# EAGLE design ESP32boardforCNCFTDI (EAGLE 9.6.2)
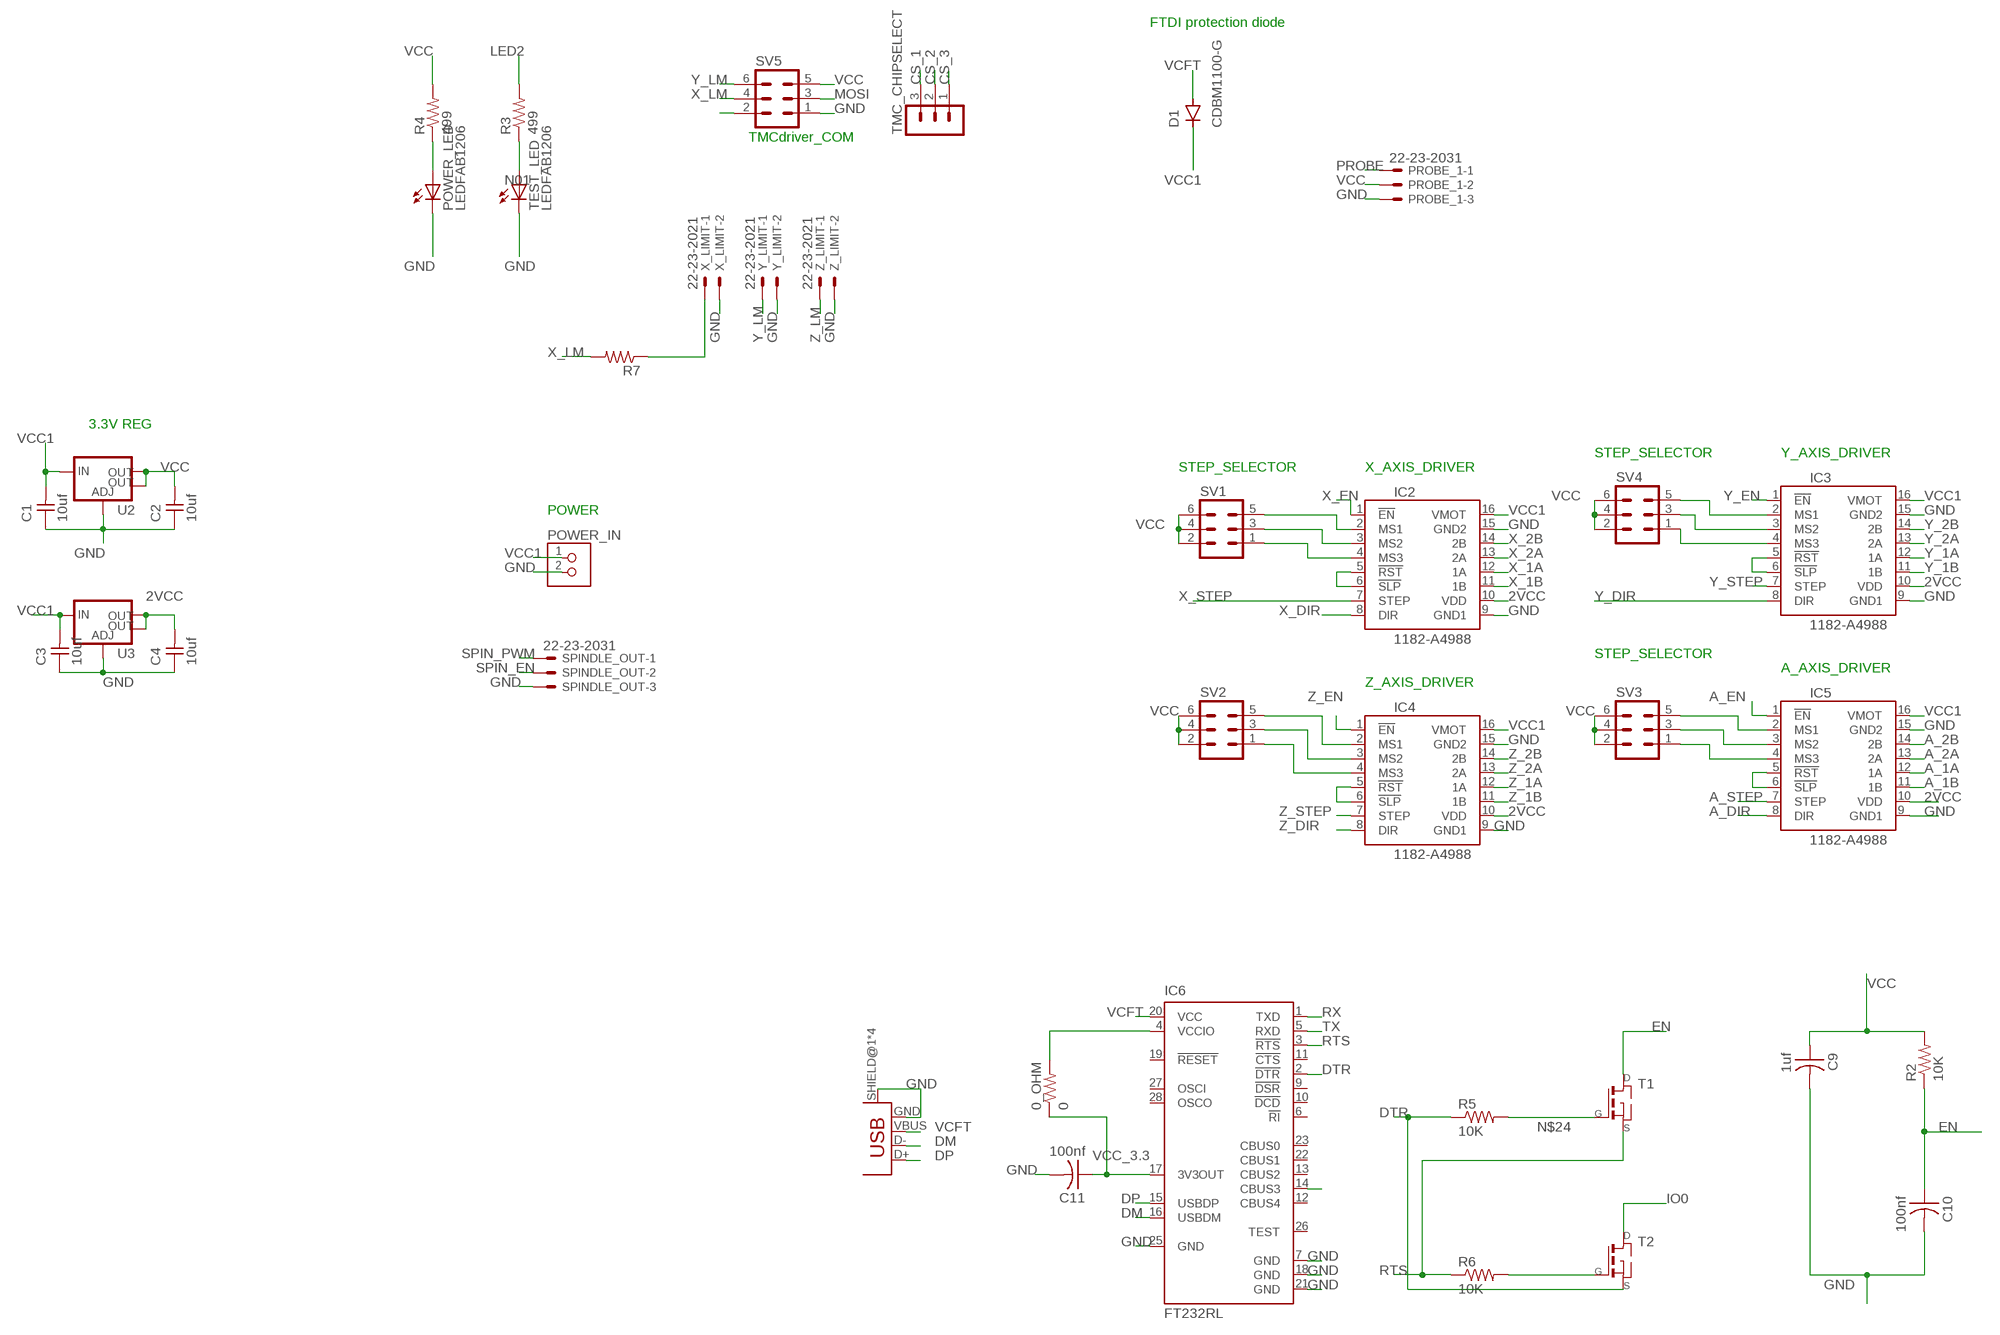
[diagram p0: schematic, sheet 1, part 1 of 2]
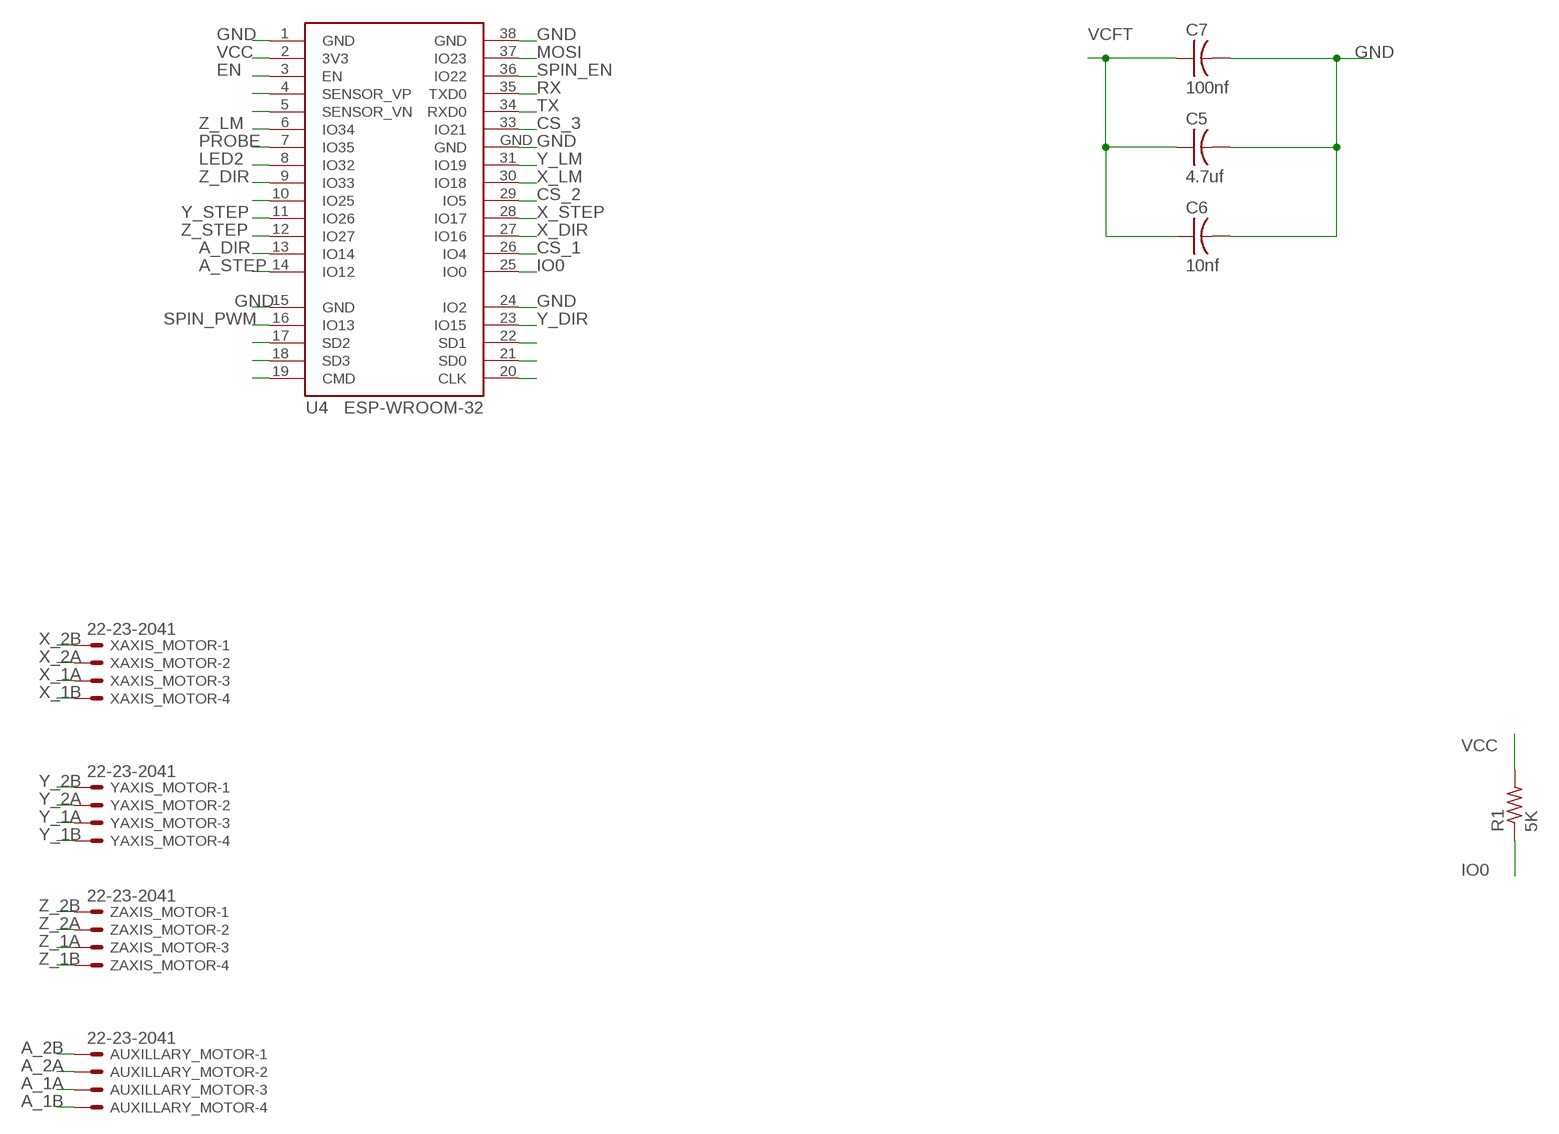
[diagram p1: schematic, sheet 1, part 2 of 2]

## Parts
0_OHM  0  RES-US1206FAB  [R1206FAB]
AUXILLARY_MOTOR  22-23-2041  [22-23-2041]
C1  10uf  CAP-UNPOLARIZEDFAB  [C1206FAB]
C2  10uf  CAP-UNPOLARIZEDFAB  [C1206FAB]
C3  10uf  CAP-UNPOLARIZEDFAB  [C1206FAB]
C4  10uf  CAP-UNPOLARIZEDFAB  [C1206FAB]
C5  4.7uf  CAP-US1206FAB  [C1206FAB]
C6  10nf  CAP-US1206FAB  [C1206FAB]
C7  100nf  CAP-US1206FAB  [C1206FAB]
C9  1uf  CAP-US1206FAB  [C1206FAB]
C10  100nf  CAP-US1206FAB  [C1206FAB]
C11  100nf  CAP-US1206FAB  [C1206FAB]
D1  CDBM1100-G  [MINI-SMA]
IC2  1182-A4988  [A4988]
IC3  1182-A4988  [A4988]
IC4  1182-A4988  [A4988]
IC5  1182-A4988  [A4988]
IC6  FT232RL  [SSOP28]
POWER_IN  TERM-1X02-ADAFRUIT  [3.5MMTERM]
POWER_LED  LEDFAB1206  [LED1206FAB]
PROBE_1  22-23-2031  [22-23-2031]
R1  5K  RES-US1206FAB  [R1206FAB]
R2  10K  RES-US1206FAB  [R1206FAB]
R3  499  RES-US1206FAB  [R1206FAB]
R4  499  RES-US1206FAB  [R1206FAB]
R5  10K  RES-US1206FAB  [R1206FAB]
R6  10K  RES-US1206FAB  [R1206FAB]
R7  RES-US1206FAB  [R1206FAB]
SPINDLE_OUT  22-23-2031  [22-23-2031]
SV1  MA03-2  [MA03-2]
SV2  MA03-2  [MA03-2]
SV3  MA03-2  [MA03-2]
SV4  MA03-2  [MA03-2]
SV5  MA03-2  [MA03-2]
T1  NMOSFETSOT23  [SOT-23]
T2  NMOSFETSOT23  [SOT-23]
TEST_LED  LEDFAB1206  [LED1206FAB]
TMC_CHIPSELECT  MA03-1  [MA03-1]
U2  V_REG_LM1117SOT223  [SOT223]
U3  V_REG_LM1117SOT223  [SOT223]
U4  ESP-WROOM-32  [ESP-WROOM-32]
U$1  USB_MINIB  [USB_MINIB]
X_LIMIT  22-23-2021  [22-23-2021]
XAXIS_MOTOR  22-23-2041  [22-23-2041]
Y_LIMIT  22-23-2021  [22-23-2021]
YAXIS_MOTOR  22-23-2041  [22-23-2041]
Z_LIMIT  22-23-2021  [22-23-2021]
ZAXIS_MOTOR  22-23-2041  [22-23-2041]

## Nets
2VCC: C4.2 IC2.10(VDD) IC3.10(VDD) IC4.10(VDD) IC5.10(VDD) U3.2(OUT) U3.4(OUT)
A_1A: AUXILLARY_MOTOR.3 IC5.12(1A)
A_1B: AUXILLARY_MOTOR.4 IC5.11(1B)
A_2A: AUXILLARY_MOTOR.2 IC5.13(2A)
A_2B: AUXILLARY_MOTOR.1 IC5.14(2B)
A_DIR: IC5.8(DIR) U4.13(IO14)
A_EN: IC5.1(!EN)
A_STEP: IC5.7(STEP) U4.14(IO12)
CS_1: TMC_CHIPSELECT.3 U4.26(IO4)
CS_2: TMC_CHIPSELECT.2 U4.29(IO5)
CS_3: TMC_CHIPSELECT.1 U4.33(IO21)
DM: IC6.16(USBDM) U$1.D-
DP: IC6.15(USBDP) U$1.D+
DTR: IC6.2(!DTR) R5.1 T2.2(S)
EN: C10.1 R2.1 T1.1(D) U4.3(EN)
GND: C1.1 C2.1 C3.1 C4.1 C5.2 C6.2 C7.2 C9.2 C10.2 C11.2 IC2.9(GND1) IC2.15(GND2) IC3.9(GND1) IC3.15(GND2) IC4.9(GND1) IC4.15(GND2) IC5.9(GND1) IC5.15(GND2) IC6.7(GND) IC6.18(GND) IC6.21(GND) IC6.25(GND) POWER_IN.2 POWER_LED.2(C) PROBE_1.3 SPINDLE_OUT.3 SV5.1 TEST_LED.2(C) U2.1(ADJ) U3.1(ADJ) U4.1(GND) U4.15(GND) U4.24(IO2) U4.38(GND) U4.GND U$1.GND U$1.SHIELD@1(SHIELD) U$1.SHIELD@2(SHIELD) U$1.SHIELD@3(SHIELD) U$1.SHIELD@4(SHIELD) X_LIMIT.2 Y_LIMIT.2 Z_LIMIT.2
IO0: R1.1 T2.1(D) U4.25(IO0)
LED2: R3.2 U4.8(IO32)
MOSI: SV5.3 U4.37(IO23)
N01: R3.1 TEST_LED.1(A)
N$1: POWER_LED.1(A) R4.1
N$2: IC2.5(!RST) IC2.6(!SLP)
N$3: IC3.5(!RST) IC3.6(!SLP)
N$4: IC4.5(!RST) IC4.6(!SLP)
N$5: IC5.5(!RST) IC5.6(!SLP)
N$6: IC4.2(MS1) SV2.5
N$7: R7.1 X_LIMIT.1
N$8: IC4.3(MS2) SV2.3
N$9: IC4.4(MS3) SV2.1
N$10: 0_OHM.2 IC6.4(VCCIO)
N$11: IC2.2(MS1) SV1.5
N$12: IC2.3(MS2) SV1.3
N$13: IC2.4(MS3) SV1.1
N$14: IC3.2(MS1) SV4.5
N$15: IC3.3(MS2) SV4.3
N$16: IC3.4(MS3) SV4.1
N$17: IC5.2(MS1) SV3.5
N$18: IC5.3(MS2) SV3.3
N$19: IC5.4(MS3) SV3.1
N$20: SV5.2
N$24: R5.2 T1.3(G)
N$25: R6.2 T2.3(G)
N$32: IC6.14(CBUS3)
N$36: U4.22(SD1)
N$37: U4.21(SD0)
N$38: U4.20(CLK)
N$39: U4.19(CMD)
N$40: U4.18(SD3)
N$41: U4.17(SD2)
N$48: U4.10(IO25)
N$53: U4.5(SENSOR_VN)
N$54: U4.4(SENSOR_VP)
PROBE: PROBE_1.1 U4.7(IO35)
RTS: IC6.3(!RTS) R6.1 T1.2(S)
RX: IC6.1(TXD) U4.35(TXD0)
SPIN_EN: SPINDLE_OUT.2 U4.36(IO22)
SPIN_PWM: SPINDLE_OUT.1 U4.16(IO13)
TX: IC6.5(RXD) U4.34(RXD0)
VCC: C2.2 C9.1 PROBE_1.2 R1.2 R2.2 R4.2 SV1.2 SV1.4 SV1.6 SV2.2 SV2.4 SV2.6 SV3.2 SV3.4 SV3.6 SV4.2 SV4.4 SV4.6 SV5.5 U2.2(OUT) U2.4(OUT) U4.2(3V3)
VCC1: C1.2 C3.2 D1.KATHODE IC2.16(VMOT) IC3.16(VMOT) IC4.16(VMOT) IC5.16(VMOT) POWER_IN.1 U2.3(IN) U3.3(IN)
VCC_3.3: 0_OHM.1 C11.1 IC6.17(3V3OUT)
VCFT: C5.1 C6.1 C7.1 D1.ANODE IC6.20(VCC) U$1.VBUS
X_1A: IC2.12(1A) XAXIS_MOTOR.3
X_1B: IC2.11(1B) XAXIS_MOTOR.4
X_2A: IC2.13(2A) XAXIS_MOTOR.2
X_2B: IC2.14(2B) XAXIS_MOTOR.1
X_DIR: IC2.8(DIR) U4.27(IO16)
X_EN: IC2.1(!EN)
X_LM: R7.2 SV5.4 U4.30(IO18)
X_STEP: IC2.7(STEP) U4.28(IO17)
Y_1A: IC3.12(1A) YAXIS_MOTOR.3
Y_1B: IC3.11(1B) YAXIS_MOTOR.4
Y_2A: IC3.13(2A) YAXIS_MOTOR.2
Y_2B: IC3.14(2B) YAXIS_MOTOR.1
Y_DIR: IC3.8(DIR) U4.23(IO15)
Y_EN: IC3.1(!EN)
Y_LM: SV5.6 U4.31(IO19) Y_LIMIT.1
Y_STEP: IC3.7(STEP) U4.11(IO26)
Z_1A: IC4.12(1A) ZAXIS_MOTOR.3
Z_1B: IC4.11(1B) ZAXIS_MOTOR.4
Z_2A: IC4.13(2A) ZAXIS_MOTOR.2
Z_2B: IC4.14(2B) ZAXIS_MOTOR.1
Z_DIR: IC4.8(DIR) U4.9(IO33)
Z_EN: IC4.1(!EN)
Z_LM: U4.6(IO34) Z_LIMIT.1
Z_STEP: IC4.7(STEP) U4.12(IO27)
Unconnected: IC6.6(!RI) IC6.9(!DSR) IC6.10(!DCD) IC6.11(!CTS) IC6.12(CBUS4) IC6.13(CBUS2) IC6.19(!RESET) IC6.22(CBUS1) IC6.23(CBUS0) IC6.26(TEST) IC6.27(OSCI) IC6.28(OSCO)

## Notes on the sheet
- FTDI protection diode
- TMCdriver_COM
- 3.3V REG
- STEP_SELECTOR | Y_AXIS_DRIVER
- STEP_SELECTOR | X_AXIS_DRIVER
- POWER
- STEP_SELECTOR
- A_AXIS_DRIVER
- Z_AXIS_DRIVER

## Library data of the parts
0_OHM R1-R7 = fab:RES-US: Resistor (US Symbol) Variants with postfix FAB are widened to allow the routing of internal traces
AUXILLARY_MOTOR XAXIS_MOTOR YAXIS_MOTOR ZAXIS_MOTOR = con-molex:22-23-2041: .100" (2.54mm) Center Header - 4 Pin; MF: MOLEX; MPN: 22-23-2041; OC_FARNELL: 1462920; OC_NEWARK: 38C0355
C1-C4 = fab:CAP-UNPOLARIZED
C5-C7 C9-C11 = fab:CAP-US
D1 = fab:CDBM1100-G: Diode schottky 100V 1A mini-SMA as found in the fablab inventory Reverse Voltage: 100 Volts Forward Current: 1.0 Amp Maximum forward voltage: 0.85 Volts Made by Zaerc.
IC2-IC5 = pololu-stepper-driver:1182-A4988: A4988 Stepper Motor Driver Carrier #1182 A4988 Stepper Motor Driver Carrier <https://www.pololu.com/product/1182> in Japan, Suzaku Lab. Ltd. <https://suzakugiken.jp/> #1182 A4988ステッピングモータドライバ <https://szc.jp/po1182>
IC6 = ftdichip2:FT232R: Source: http://www.ftdichip.com/Documents/DataSheets/DS_FT232R_v104.pdf; MPN: FT232RL; OC_FARNELL: 1146032; OC_NEWARK: 91K9918
POWER_IN = fab:TERM-1X02: 3.5mm terminal block, 2 positions ED555-2DS as found in the fablab inventory. Stolen from Adafruit <http://www.ladyada.net/library/pcb/eaglelibrary.html>, adapted by Zaerc.
POWER_LED TEST_LED = fab:LED: LED
PROBE_1 SPINDLE_OUT = con-molex:22-23-2031: .100" (2.54mm) Center Header - 3 Pin; MF: MOLEX; MPN: 22-23-2031; OC_FARNELL: 1462950; OC_NEWARK: 30C0862
SV1-SV5 = con-lstb:MA03-2: PIN HEADER; OC_FARNELL: unknown; OC_NEWARK: unknown
T1 T2 = fab:NMOSFET: MOS FET
TMC_CHIPSELECT = con-lstb:MA03-1: PIN HEADER; OC_FARNELL: unknown; OC_NEWARK: unknown
U2 U3 = fab:V_REG_LM1117: Voltage Regulator LM1117 Standard adjustable voltage regulator but in SMD form. Spark Fun Electronics SKU : COM-00595; PROD_ID: VREG-08170
U4 = esp32:ESP-WROOM-32: Espressif Systems ESP-WROOM-32
U$1 = fab:USB_MINIB
X_LIMIT Y_LIMIT Z_LIMIT = con-molex:22-23-2021: .100" (2.54mm) Center Header - 2 Pin; MF: MOLEX; MPN: 22-23-2021; OC_FARNELL: 1462926; OC_NEWARK: 25C3832

## Board
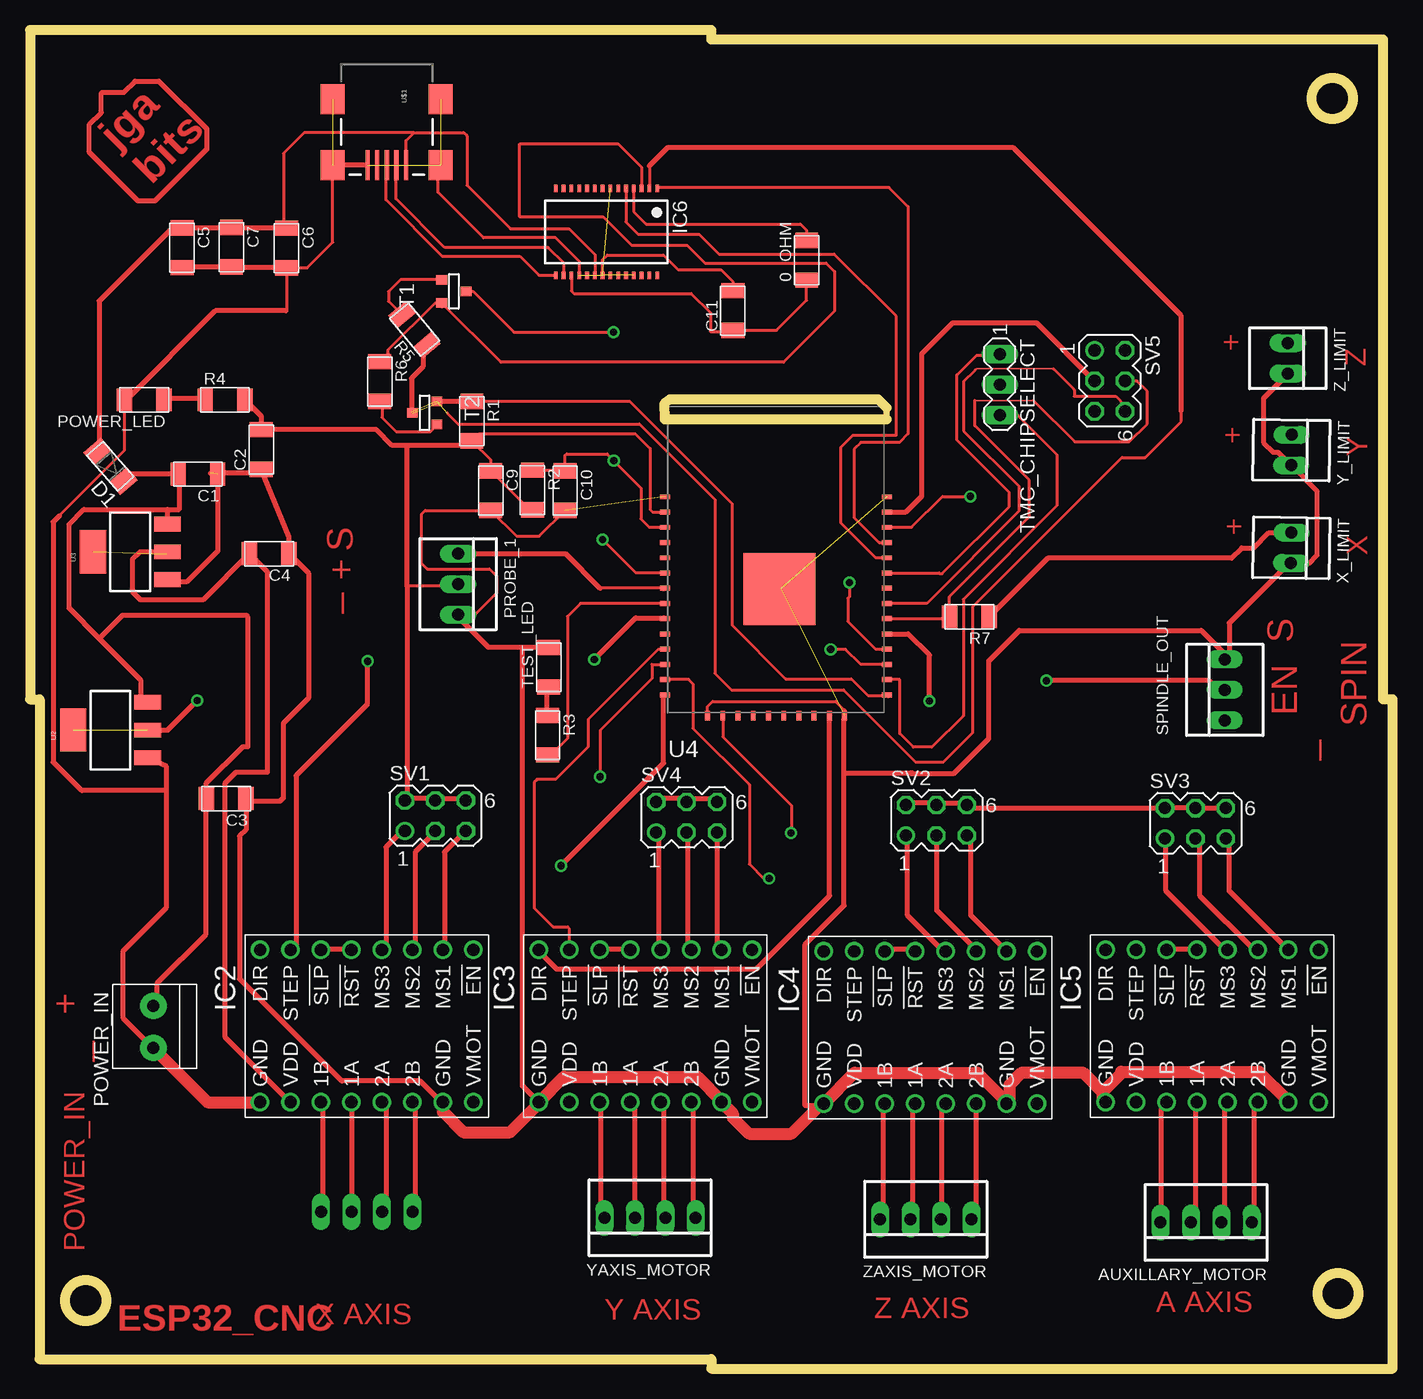
[diagram p2: board, top side]
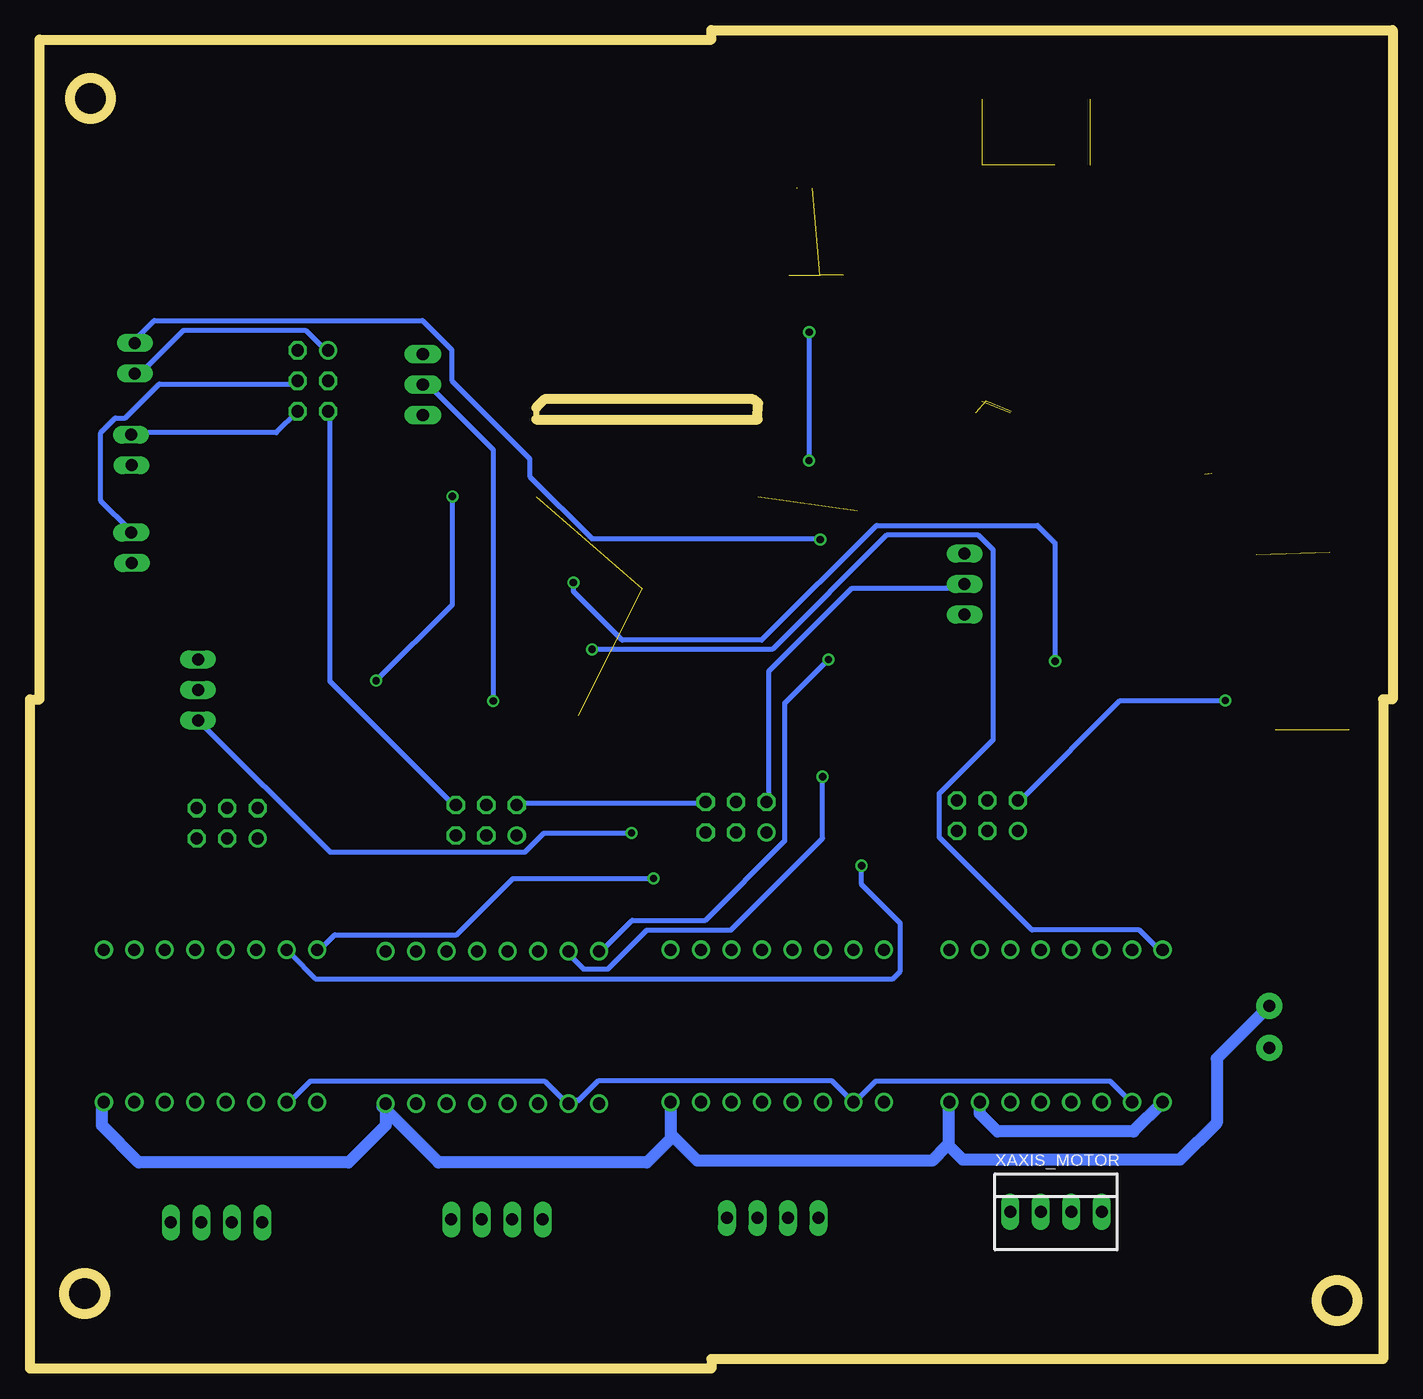
[diagram p3: board, bottom side, seen from below]

Size 113.6 x 111.6 mm. Coordinates in mm from the lower left corner, seen from the top.
Outline: 0.8,55.8 0.8,0.8 56.8,0.8 56.8,0 113.6,0 113.6,55.8 112.8,55.8 112.8,110.8 56.8,110.8 56.8,111.6 0,111.6 0,55.8 0.8,55.8
Outline: 53.34,80.82 70.69,80.82 71.4,80.11 71.4,79.12 52.93,79.12 52.91,80.49 53.34,80.82
Outline: circle at 108.56,105.89 radius 1.71
Outline: circle at 109.04,6.27 radius 1.71
Outline: circle at 4.65,5.69 radius 1.71
Copper layers (1*16): Top 0.035mm / dielectric 1.5mm / Bottom 0.035mm
Design rules "default *": minimum track width 5mil, minimum drill 0.6mm, track to track 10mil, track to pad 5mil, pad to pad 5mil, via to via 5mil, smd to smd 10mil, copper to edge 5mil, drill to drill 10mil, minimum pad ring 10mil, minimum via ring 8mil, stop-mask expansion 4mil, vias tented up to drill 0mil, thermal gap 10mil

### Footprints (pad centres in the part's own frame; a part is rotated, then mirrored left to right if it is on the bottom)
R1206FAB = smd 1.27 x 1.905: 1 -1.651,0; 2 1.651,0
22-23-2041 = drill 1 long: 1 -3.81,0; 2 -1.27,0; 3 1.27,0; 4 3.81,0
C1206FAB = smd 1.27 x 1.905: 1 -1.651,0; 2 1.651,0
MINI-SMA = smd 1.4 x 1.9: ANODE 1.65,0; KATHODE -1.65,0
A4988 = drill 1.016: 1 -6.35,8.89; 2 -6.35,6.35; 3 -6.35,3.81; 4 -6.35,1.27; 5 -6.35,-1.27; 6 -6.35,-3.81; 7 -6.35,-6.35; 8 -6.35,-8.89; 9 6.35,-8.89; 10 6.35,-6.35; 11 6.35,-3.81; 12 6.35,-1.27; 13 6.35,1.27; 14 6.35,3.81; 15 6.35,6.35; 16 6.35,8.89
SSOP28 = smd 0.305 x 0.61: 1 -4.225,-3.625; 2 -3.575,-3.625; 3 -2.925,-3.625; 4 -2.275,-3.625; 5 -1.625,-3.625; 6 -0.975,-3.625; 7 -0.325,-3.625; 8 0.325,-3.625; 9 0.975,-3.625; 10 1.625,-3.625; 11 2.275,-3.625; 12 2.925,-3.625; 13 3.575,-3.625; 14 4.225,-3.625; 15 4.225,3.625; 16 3.575,3.625; 17 2.925,3.625; 18 2.275,3.625; 19 1.625,3.625; 20 0.975,3.625; 21 0.325,3.625; 22 -0.325,3.625; 23 -0.975,3.625; 24 -1.625,3.625; 25 -2.275,3.625; 26 -2.925,3.625; 27 -3.575,3.625; 28 -4.225,3.625
3.5MMTERM = drill 1 pad 2.184: 1 1.8,0; 2 -1.7,0
LED1206FAB = smd 1.27 x 1.905: 1 -1.651,0; 2 1.651,0
22-23-2031 = drill 1 long: 1 -2.54,0; 2 0,0; 3 2.54,0
MA03-2 = drill 1.016: 1 -2.54,-1.27 | drill 1.016 octagon: 2 -2.54,1.27; 3 0,-1.27; 4 0,1.27; 5 2.54,-1.27; 6 2.54,1.27
SOT-23 = smd 0.787 x 0.889: 1 0.025,-1.016; 2 -0.94,1.016; 3 0.991,1.016
MA03-1 = drill 1.016 long: 1 -2.54,0; 2 0,0; 3 2.54,0
SOT223 = smd 1.219 x 2.235: 1 -2.311,-3.099; 2 0,-3.099; 3 2.311,-3.099 | smd 3.6 x 2.2: 4 0,3.099
ESP-WROOM-32 = smd 0.813 x 0.406: 1 -9.25,7; 2 -9.25,5.73; 3 -9.25,4.46; 4 -9.25,3.19; 5 -9.25,1.92; 6 -9.25,0.65; 7 -9.25,-0.62; 8 -9.25,-1.89; 9 -9.25,-3.16; 10 -9.25,-4.43; 11 -9.25,-5.7; 12 -9.25,-6.97; 13 -9.25,-8.24; 14 -9.25,-9.51; 25 9.25,-9.51; 26 9.25,-8.24; 27 9.25,-6.97; 28 9.25,-5.7; 29 9.25,-4.43; 30 9.25,-3.16; 31 9.25,-1.89; 32 9.25,-0.62; 33 9.25,0.65; 34 9.25,1.92; 35 9.25,3.19; 36 9.25,4.46; 37 9.25,5.73; 38 9.25,7 | smd 0.406 x 0.813: 15 -5.7,-11.25; 16 -4.43,-11.25; 17 -3.16,-11.25; 18 -1.89,-11.25; 19 -0.62,-11.25; 20 0.65,-11.25; 21 1.92,-11.25; 22 3.19,-11.25; 23 4.46,-11.25; 24 5.73,-11.25 | smd 6 x 6: GND 0.3,-0.7
USB_MINIB = smd 2.5 x 0.35: D+ 3.77,0; D- 3.77,0.8; GND 3.77,-1.6; ID 3.77,-0.8; VBUS 3.77,1.6 | smd 2.5 x 2: SHIELD@1 -1.73,-4.5; SHIELD@2 -1.73,4.5; SHIELD@3 3.77,4.5; SHIELD@4 3.77,-4.5
22-23-2021 = drill 1 long: 1 -1.27,0; 2 1.27,0

### Placement (x,y rotation side)
0_OHM  64.74,92.41 90 top
AUXILLARY_MOTOR  98.04,12.19 180 top
C1  14,74.57 180 top
C2  19.28,76.63 90 top
C3  16.36,47.52 180 top
C4  19.94,67.94 180 top
C5  12.67,93.45 270 top
C6  21.39,93.42 270 top
C7  16.79,93.5 270 top
C9  38.4,73.2 270 top
C10  44.6,73.2 270 top
C11  58.6,88.21 90 top
D1  6.71,75.23 131.1 top
IC2  28.07,28.57 270 top
IC3  51.31,28.57 270 top
IC4  75.06,28.45 270 top
IC5  98.55,28.57 270 top
IC6  48.06,94.77 180 top
POWER_IN  10.29,28.45 90 top
POWER_LED  9.53,80.77 180 top
PROBE_1  35.69,65.41 270 top
R1  36.83,78.99 270 top
R2  41.88,73.25 270 top
R3  43.15,52.8 270 top
R4  16.26,80.77 0 top
R5  32.05,86.61 129.6 top
R6  29.16,82.3 270 top
R7  78.31,62.69 180 top
SPINDLE_OUT  99.6,56.59 90 top
SV1  33.78,46.1 0 top
SV2  75.56,45.72 0 top
SV3  97.16,45.47 0 top
SV4  54.74,45.97 0 top
SV5  90.02,82.35 270 top
T1  35.33,89.79 90 top
T2  32.89,79.71 270 top
TEST_LED  43.23,58.47 90 top
TMC_CHIPSELECT  80.85,82.04 270 top
U2  6.71,53.24 90 top
U3  8.36,68.1 90 top
U4  62.18,65.68 0 top
U$1  29.74,104.11 270 top
X_LIMIT  105.14,68.43 269 top
XAXIS_MOTOR  28.07,13.08 0 bottom
Y_LIMIT  105.16,76.58 269 top
YAXIS_MOTOR  51.69,12.57 180 top
Z_LIMIT  104.86,84.24 270 top
ZAXIS_MOTOR  74.68,12.45 180 top

### Tracks (layer width: path | path; a pad name or v marks a point on that pad's centre or on a via)
2VCC  (1 unrouted)
  Top 0.406: 5.28,67.06 5.28,67.87 U3.4 | 11.38,67.87 U3.2 9.17,68.1 8.53,67.46 8.53,64.8 9.25,64.08 14.43,64.08 C4.2 19.79,66.45 19.79,49.73 17.17,49.73 16.28,48.84 16.28,27.61 21.54,22.35 IC2.10
  Bottom 0.406: IC5.10 91.85,22.35 90.22,23.98 70.71,23.98 69.09,22.35 IC4.10 68.68,22.35 67.87,22.35 66.24,23.98 46.74,23.98 45.11,22.35 IC3.10 44.7,22.35 43.08,23.98 23.57,23.98 21.95,22.35 IC2.10
A_1A
  Top 0.406: AUXILLARY_MOTOR.3 97.13,12.19 97.13,21.95 IC5.12
A_1B
  Top 0.406: AUXILLARY_MOTOR.4 94.28,12.19 94.28,21.54 94.69,21.95 IC5.11
A_2A
  Top 0.406: AUXILLARY_MOTOR.2 99.57,12.19 99.57,21.95 IC5.13
A_2B
  Top 0.406: AUXILLARY_MOTOR.1 102.01,12.19 102.01,21.95 IC5.14
A_DIR  (via drill 0.6)
  Top 0.254: U4.13 52.94,57.45 54.91,57.45 55.27,57.1 55.27,53.39 59.97,48.69 59.97,42.06 61.16,40.87 v61.62,40.87
  Bottom 0.406: v61.62,40.87 73.33,40.87 78.03,36.17 88.19,36.17 89.41,34.95 IC5.8
A_STEP  (via drill 0.6)
  Top 0.406: v44.27,41.94 52.83,50.49 52.83,56.08 U4.14
  Bottom 0.406: v44.27,41.94 44.27,40.36 41.05,37.13 41.05,33.12 41.66,32.51 89.81,32.51 91.85,34.54 IC5.7
CS_1
  Top 0.254: U4.26 72.52,57.44 72.52,52.93 73.64,51.82 75.18,51.82 77.8,54.43 77.8,64.14 85.62,71.96 85.62,76.2 82.32,79.5 TMC_CHIPSELECT.3
  Top 0.406: 80.87,79.25 TMC_CHIPSELECT.3
CS_2  (via drill 0.6)
  Top 0.406: U4.29 73.21,61.25 74.98,59.48 v74.98,55.65
  Bottom 0.406: v74.98,55.65 74.98,76.61 80.47,82.09 TMC_CHIPSELECT.2
CS_3
  Top 0.254: U4.33 75.78,66.33 75.84,66.27 76.02,66.27 81.64,71.88 81.64,73.05 77.27,77.42 77.27,82.83 78.92,84.48 80.75,84.48 TMC_CHIPSELECT.1
DM
  Top 0.254: U$1.D- 30.5,100.31 30.5,97.54 34.57,93.47 43.2,93.47 44.48,92.2 IC6.16
DP
  Top 0.254: U$1.D+ 29.67,100.27 29.67,97.43 34.37,92.73 40.84,92.73 42.44,91.14 IC6.15
DTR  (2 unrouted)
  Top 0.254: 34.77,79.68 35.69,78.77 50.8,78.77 57.1,72.47 57.1,57.96 58.47,56.59 67.82,56.59 73.81,50.6 76.15,50.6 78.59,53.03 78.59,63.52 91.03,75.97 92.96,75.97 95.96,78.97 95.96,79.86 | 51.63,100.27 IC6.2
  Top 0.406: R5.1 32.77,85 32.77,83.54 31.8,82.58 31.8,79.81 | 51.63,100.27 53.14,101.78 81.97,101.78 95.96,87.78 95.96,79.86
EN  (via drill 0.6)
  Top 0.254: C10.1 44.4,74.65 | R2.1 44.55,74.91 C10.1 | T1.1 36.93,89.81 40.34,86.41 v48.64,86.41 | U4.3 51.62,70.14 50.93,70.84 50.93,73.43 v48.67,75.69 48.11,76.25 44.73,76.25 44.6,76.12 C10.1
  Bottom 0.406: v48.67,75.69 48.67,86.39 v48.64,86.41
GND  (10 unrouted)
  Top 0.254: U4.15 56.48,55.21 56.9,55.63 67.16,55.63 67.87,54.91 67.87,54.86 67.87,49.66 | U$1.SHIELD@4 25.24,93.9 23.11,91.77 C6.2 21.39,88.25 21.32,88.19 | POWER_LED.2 7.87,76.56 2.44,71.12 2.44,71.09 | C10.2 42.44,69.39 40.56,69.39 C9.2 32.94,71.55 32.61,71.22 32.61,67.18 33.12,66.67 38.3,66.67 38.91,66.06 38.91,64.67 37.11,62.87 PROBE_1.3 | U$1.SHIELD@3 34.01,100.11 34.01,98.07 37.8,94.28 43.81,94.28 45.78,92.32 IC6.18 | IC6.21 47.73,92.44 48.13,92.84 52.81,92.84 54.03,91.62 57.61,91.62 58.6,90.63 C11.2
  Top 0.406: SPINDLE_OUT.3 99.97,59.33 99.97,62.18 104.85,67.06 X_LIMIT.2 105.19,67.08 106.55,67.08 107.29,67.82 107.29,73.15 105.26,75.18 Y_LIMIT.2 104.85,75.59 104.04,76.4 103.63,76.4 102.82,77.22 102.82,80.87 104.85,82.91 Z_LIMIT.2 | 62.18,65.02 U4.GND | 56.49,54.46 U4.15 | U4.GND 62.18,64.62 60.15,62.59 U4.GND | 67.87,54.86 67.87,54.46 U4.24 67.87,54.05 67.87,38.61 64.62,35.36 64.62,21.95 65.84,21.95 IC4.9 | 62.59,65.02 U4.GND | 57.71,21.95 IC3.15 57.3,22.35 | 81.69,22.35 IC4.15 81.28,22.35 | 89.41,22.35 IC5.9 89.81,22.35 | 104.85,22.35 IC5.15 | 67.87,49.66 73.36,49.66 | 73.58,49.66 73.36,49.66 | 99.53,59.59 SPINDLE_OUT.3 | C7.2 16.91,91.85 | C7.2 21.13,91.85 C6.2 | C7.2 13.01,91.85 C5.2 | 8.13,80.47 POWER_LED.2 8.13,80.87 15.44,88.19 21.32,88.19 | 11.38,48.18 11.38,38.46 7.77,34.85 7.77,29.21 10.16,26.82 POWER_IN.2 10.57,26.42 | 11.38,48.18 11.38,50.2 U2.1 | 11.79,65.43 U3.1 11.66,65.58 13.06,65.58 15.65,68.17 C1.1 | 41.05,60.15 38.2,60.15 35.76,62.59 PROBE_1.3 | 41.05,60.15 43.08,60.15 TEST_LED.2 | 34.54,21.95 IC2.15 34.14,22.35 32.51,23.98 25.98,23.98 17.48,32.49 17.48,44.4 18.01,44.93 C3.1 18.01,47.3 | 42.27,21.95 IC3.9 | 19.1,21.95 IC2.9 | 41.05,60.15 41.05,23.57 42.27,22.35 IC3.9 | 2.44,71.09 1.93,70.59 1.93,50.57 4.32,48.18 11.38,48.18 | 42.67,22.35 IC3.9 | 34.24,99.64 U$1.SHIELD@3 | U$1.GND U$1.SHIELD@4 | 73.36,49.66 73.38,49.63 77.04,49.63 79.93,52.53 79.93,59 82.47,61.54 97.64,61.54 99.6,59.58 SPINDLE_OUT.3 | 18.01,47.3 20.83,47.3 21.11,47.57 21.11,53.8 23.22,55.91 23.22,66.32 C4.1 21.59,69.33 C2.1 18.95,74.65 15.06,74.65 | 18.01,47.3 17.96,47.3
  Top 1.016: POWER_IN.2 14.81,22.23 IC2.9 | IC2.15 34.42,21.41 36.12,19.71 40.03,19.71 42.27,21.95 | IC3.9 44.53,24.33 55.63,24.33 57.66,22.3 IC3.15 58.6,21.29 58.6,20.93 59.94,19.58 63.48,19.58 65.84,21.95 | IC4.9 68.73,24.66 78.97,24.66 81.28,22.35 | IC4.15 81.69,22.38 81.69,23.67 82.7,24.69 87.76,24.69 89.41,23.04 | 89.41,23.04 89.41,22.35 | 89.41,23.04 90.96,24.59 90.96,24.77 102.44,24.77 104.85,22.35
  Bottom 0.406: SV5.1 89,84.94 90.63,86.56 100.79,86.56 104.04,83.31 104.85,83.31 Z_LIMIT.2 | 19.51,21.95 IC2.9
  Bottom 1.016: IC2.9 21.61,19.79 32.94,19.79 34.42,21.26 IC2.15
IO0  (1 unrouted)
  Top 0.254: R1.1 49.99,80.64 58.52,72.11 58.52,61.98 62.99,57.51 68.48,57.51 69.85,56.13 71.39,56.13 U4.25
  Top 0.406: 71.53,56.08 U4.25 | 37.08,81.03 R1.1 36.68,80.62 34.24,80.62
LED2
  Top 0.254: U4.8 45.89,63.79 44.81,62.71 44.81,52.53 43.48,51.21
  Top 0.406: 52.83,63.8 U4.8 | 43.48,51.21 R3.2
MOSI
  Top 0.406: U4.37 71.47,71.37 72.97,71.37 74.32,72.72 74.32,84.58 76.91,87.17 83.92,87.17 SV5.3
N01
  Top 0.406: R3.1 43.08,54.46 43.08,56.49 TEST_LED.1
N$1
  Top 0.406: POWER_LED.1 11.38,80.87 14.22,80.87 R4.1
N$2
  Top 0.406: IC2.6 24.38,34.95 26.42,34.95 IC2.5
N$3
  Top 0.406: IC3.6 47.55,34.95 49.99,34.95 IC3.5
N$4
  Top 0.406: IC4.6 71.53,34.95 73.56,34.95 IC4.5
N$5
  Top 0.406: IC5.6 95.1,34.95 97.13,34.95 IC5.5
N$6
  Top 0.406: SV2.5 78.44,44.3 78.44,37.8 81.28,34.95 IC4.2
N$7
  Top 0.406: R7.1 84.84,67.56 100.15,67.56 101.01,68.42 102,68.42 103.28,69.7 X_LIMIT.1
N$8
  Top 0.406: SV2.3 75.59,44.3 75.59,38.2 78.84,34.95 IC4.3
N$9
  Top 0.406: SV2.1 73.15,44.3 73.15,37.8 76,34.95 IC4.4
N$10
  Top 0.254: IC6.4 50.33,96.45 51.36,95.43 64.21,95.43 64.75,94.89 0_OHM.2
N$11
  Top 0.406: IC2.2 34.54,34.95 34.54,43.08 36.17,44.7 SV1.5
N$12
  Top 0.406: IC2.3 32.11,34.95 32.11,43.08 33.73,44.7 SV1.3
N$13
  Top 0.406: IC2.4 29.67,34.95 29.67,43.48 30.89,44.7 SV1.1
N$14
  Top 0.406: SV4.5 57.3,44.7 57.3,34.95 IC3.2
N$15
  Top 0.406: SV4.3 54.86,44.7 54.86,34.95 IC3.3
N$16
  Top 0.406: SV4.1 52.43,44.7 52.43,34.95 IC3.4
N$17
  Top 0.406: SV3.5 99.97,43.89 99.97,39.83 104.85,34.95 IC5.2
N$18
  Top 0.406: SV3.3 97.54,43.89 97.54,39.42 102.01,34.95 IC5.3
N$19
  Top 0.406: SV3.1 94.69,43.89 94.69,39.83 99.57,34.95 IC5.4
N$21
  Top 0.406: 6.02,106.4 7.82,106.4 8.76,107.34 10.74,107.34 14.73,103.35 14.73,101.65 10.41,97.33 9.02,97.33 4.95,101.4 4.95,103.73 5.94,104.72 5.94,106.35
N$24
  Top 0.254: T1.3 30.89,90.78 29.9,89.79 29.9,88.99 R5.2
N$25
  Top 0.254: R6.2 29.34,80.47 29.34,79.3 30.5,78.13 33.38,78.13 33.83,78.59
  Top 0.406: 33.83,78.59 T2.3 | 28.96,80.62 R6.2
PROBE
  Top 0.254: U4.7 47.54,65.06 47.52,65.05
  Top 0.406: 52.83,65.02 U4.7 | PROBE_1.1 44.63,67.94 47.52,65.05
RTS
  Top 0.254: R6.1 29.87,84.66 29.87,84.95 33.77,88.85 T1.2 39.27,83.9 62.81,83.9 67.08,88.16 67.08,91.47 66.37,92.18 56.26,92.18 54.79,93.65 50.16,93.65 47.78,96.04 40.82,96.04 40.82,102.11 49.02,102.11 50.98,100.15 IC6.3
  Top 0.406: R6.1 29.16,84.35 | T1.2 34.31,88.59
RX
  Top 0.254: U4.35 70.78,68.87 68.71,70.94 68.71,76.66 69.26,77.22 72.48,77.22 73.2,77.93 73.2,96.88 71.61,98.47 52.36,98.47 IC6.1
SPIN_EN  (via drill 0.6)
  Top 0.254: U4.36 73.5,70.14 76.07,72.72 v78.38,72.72
  Top 0.406: v84.73,57.35 84.76,57.38 98.27,57.38 98.75,56.9 99.57,56.9 SPINDLE_OUT.2
  Bottom 0.406: v84.73,57.35 78.38,63.7 v78.38,72.72
SPIN_PWM  (via drill 0.6)
  Top 0.254: U4.16 57.76,52.68 63.48,46.97 63.48,44.68 v63.45,44.65
  Bottom 0.406: v63.45,44.65 70.76,44.65 72.34,43.08 88.59,43.08 99.57,54.05 SPINDLE_OUT.1
TX  (1 unrouted)
  Top 0.254: U4.34 70.5,67.6 67.59,70.51 67.59,76.82 68.59,77.83 72.21,77.83 72.21,87.73 67.03,92.91 57.44,92.91 55.79,94.56 50.7,94.56 49.68,95.58 49.68,98.47
VCC  (via drill 0.6)  (1 unrouted)
  Top 0.254: U4.2 51.88,71.41 51.69,71.6 51.69,76.71 50.49,77.9 37.39,77.9 R1.2 38.41,75.77 C9.1 41.66,71.6 R2.2 41.76,71.6 | PROBE_1.2 35.53,65.25 31.42,65.25
  Top 0.406: SV3.6 SV3.4 SV3.2 78.44,46.74 SV2.6 78.03,47.14 75.59,47.14 SV2.4 75.18,47.14 73.15,47.14 SV2.2 | SV4.2 52.43,47.55 54.46,47.55 SV4.4 54.86,47.55 56.9,47.55 SV4.6 | 37.08,76.96 R1.2 36.68,76.96 31.55,76.96 | 33.33,47.55 33.73,47.55 SV1.4 | 33.33,47.55 31.42,47.55 | 31.42,47.55 31.29,47.55 SV1.2 | SV1.6 36.17,47.55 34.14,47.55 SV1.4 | 18.29,80.47 R4.2 19.28,79.4 C2.2 28.88,78.28 30.2,76.96 31.55,76.96 | 31.42,47.55 31.42,65.25 31.42,76.83 31.55,76.96 | 33.33,47.55 SV1.4 | 35.36,65.43 PROBE_1.2 | U2.2 11.48,53.24 v13.95,55.7
  Bottom 0.406: SV5.5 88.59,79.65 88.59,57.3 78.44,47.14 SV2.6 | SV4.6 57.3,47.14 72.75,47.14 SV2.2 | v13.95,55.7 22.73,55.7 30.89,47.55 SV1.2 | SV4.2 52.02,47.55 52.02,58.14 45.14,65.02 35.76,65.02 PROBE_1.2
VCC1
  Top 0.406: 11.79,70.71 U3.3 11.46,71.63 | POWER_IN.1 10.57,30.48 10.57,32.11 14.63,36.17 14.63,47.14 C3.2 | 11.46,71.63 4.5,71.63 3.25,70.38 3.25,63.4 5.77,60.88 | 11.46,71.63 12.42,71.63 12.42,74.5 C1.2 8.37,74.57 D1.KATHODE | 5.77,60.88 9.23,57.42 9.23,56.13 U2.3 | 14.71,47.83 C3.2 | C3.2 14.71,48.82 17.75,51.87 18.19,51.87 18.19,62.66 18.06,62.79 7.69,62.79 5.77,60.88
  Bottom 0.406: 83.72,21.95 IC4.16 84.12,21.95 84.21,21.86 | 60.55,21.95 IC3.16 60.15,21.95 | 36.98,21.95 IC2.16 36.58,21.95 | 107.29,21.95 IC5.16 | 10.57,30.07 POWER_IN.1
  Bottom 1.016: POWER_IN.1 14.68,25.85 14.68,20.47 17.73,17.42 35.84,17.42 36.98,18.57 | 36.98,18.57 36.98,21.95 | 36.98,18.57 37.19,18.57 38.41,17.35 57.96,17.35 60.2,19.58 | IC3.16 60.2,19.58 | 60.2,19.58 60.2,19.18 62.18,17.2 79.55,17.2 84.21,21.86 | IC4.16 83.95,20.3 87.05,17.2 104.52,17.2 107.59,20.27 107.59,22.07 IC5.16
VCC_3.3
  Top 0.254: IC6.17 45.13,89.84 45.34,89.64 55.12,89.64 56.72,88.04 56.72,86.46 58.5,86.46 C11.1 62.23,86.56 64.75,89.08 0_OHM.1
VCFT
  Top 0.254: U$1.VBUS 31.34,102.39 32,103.05 | 32,103.05 36.14,103.05 36.42,102.77 36.42,98.65 40.06,95.02 44.96,95.02 47.09,92.89 47.09,91.15 IC6.20 | 32,103.05 22.86,103.05 21.13,101.32 21.13,95.1
  Top 0.406: 21.54,94.69 C6.1 21.13,95.1 17.07,95.1 C7.1 16.66,95.1 C5.1 11.86,95.1 5.77,89 5.77,76.62 D1.ANODE
X_1A
  Top 0.406: XAXIS_MOTOR.3 26.82,13.41 26.82,21.95 IC2.12
X_1B
  Top 0.406: XAXIS_MOTOR.4 24.38,13.41 24.38,21.95 IC2.11
X_2A
  Top 0.406: XAXIS_MOTOR.2 29.67,13.41 29.67,21.95 IC2.13
X_2B
  Top 0.406: XAXIS_MOTOR.1 32.11,13.41 32.11,21.95 IC2.14
X_DIR  (via drill 0.6)
  Top 0.254: U4.27 69.25,58.71 68,59.97 v66.75,59.97
  Bottom 0.406: v66.75,59.97 51.71,59.97 42.19,69.49 34.54,69.49 33.3,68.25 33.3,52.45 37.8,47.95 37.8,44.3 30.07,36.58 21.13,36.58 19.51,34.95 IC2.8
X_LM
  Top 0.127: 78.77,80.72 83.64,80.72
  Top 0.254: U4.30 76.49,62.52 R7.2 76.66,64.36 83.31,71.02 83.31,74.07 78.77,78.61 78.77,80.72 | SV5.4 92.28,82.35 93.14,81.48 93.14,78.77 91.64,77.27 87.1,77.27 83.64,80.72
  Bottom 0.406: 105.26,69.9 107.7,72.34 107.7,78.03 106.48,79.25 105.66,79.25 102.82,82.09 91.44,82.09 SV5.4
X_STEP  (via drill 0.6)
  Top 0.254: v68.3,65.53 68.3,64.34 68.17,64.21 68.17,62.31 70.5,59.98 U4.28
  Top 0.406: v28.14,58.98 28.14,55.42 22.17,49.45 22.17,34.98 IC2.7
  Bottom 0.406: v68.3,65.53 68.3,64.8 64.24,60.73 52.6,60.73 43.03,70.31 29.62,70.31 28.14,68.83 v28.14,58.98
Y_1A
  Top 0.406: YAXIS_MOTOR.3 50.39,12.6 50.39,21.95 IC3.12
Y_1B
  Top 0.406: YAXIS_MOTOR.4 47.55,12.6 47.55,21.95 IC3.11
Y_2A
  Top 0.406: YAXIS_MOTOR.2 52.83,12.6 52.83,21.95 IC3.13
Y_2B
  Top 0.406: YAXIS_MOTOR.1 55.27,12.6 55.27,21.95 IC3.14
Y_DIR
  Top 0.406: U4.23 66.65,54.05 66.65,39.42 60.55,33.33 43.89,33.33 42.67,34.54 IC3.8
Y_LM
  Top 0.127: 78.8,83.25 78.92,83.36 85.29,83.36
  Top 0.254: SV5.6 91.29,80.29 90.5,81.08 87.05,81.08 87.05,81.61 85.29,83.36 | 71.53,63.8 74.75,63.8 82.45,71.5 82.45,73.56 77.83,78.18 77.83,82.27 78.8,83.25
  Top 0.406: 71.53,63.8 U4.31 | 91.03,79.65 SV5.6
  Bottom 0.406: SV5.6 93.07,78.03 104.85,78.03 Y_LIMIT.1
Y_STEP
  Top 0.254: U4.11 52.39,59.98 46.53,54.13 46.53,51.84 43.81,49.12 42.27,49.12 42.04,48.9 42.04,38.41 43.61,36.83 44.83,36.83 44.96,36.7 IC3.7
  Top 0.406: 45.11,34.95 IC3.7
Z_1A
  Top 0.406: ZAXIS_MOTOR.3 73.56,12.6 73.56,21.95 IC4.12
Z_1B
  Top 0.406: ZAXIS_MOTOR.4 71.12,12.6 71.12,21.95 IC4.11
Z_2A
  Top 0.406: ZAXIS_MOTOR.2 76,12.6 76,21.95 IC4.13
Z_2B
  Top 0.406: ZAXIS_MOTOR.1 78.84,12.6 78.84,21.95 IC4.14
Z_DIR  (via drill 0.6)
  Top 0.406: v47.04,59.13 50.49,62.59 52.83,62.59 U4.9
  Bottom 0.406: v47.04,59.13 50.7,55.47 50.7,43.99 57.3,37.39 63.4,37.39 65.84,34.95 IC4.8
Z_LM  (via drill 0.6)
  Top 0.254: U4.6 50.51,66.33 v47.73,69.11
  Bottom 0.406: v47.73,69.11 47.8,69.19 66.75,69.19 71.93,74.37 71.93,75.87 78.44,82.37 78.44,84.94 80.87,87.38 103.23,87.38 104.85,85.75 Z_LIMIT.1
Z_STEP  (via drill 0.6)
  Top 0.254: U4.12 51.84,58.71 51.84,57.53 47.52,53.21 v47.52,49.35
  Bottom 0.406: v47.52,49.35 47.52,44.22 55.17,36.58 62.18,36.58 65.43,33.33 67.46,33.33 68.68,34.54 IC4.7

### Text on the board
Top: jga / bits | + | Z | + | Y | + | S | X | + | _ | S | SPIN | EN | _ | + | _ | POWER_IN | A AXIS | X AXIS | Y AXIS | Z AXIS | ESP32_CNC